# EAGLE schematic led-analog (EAGLE 9.5.2)
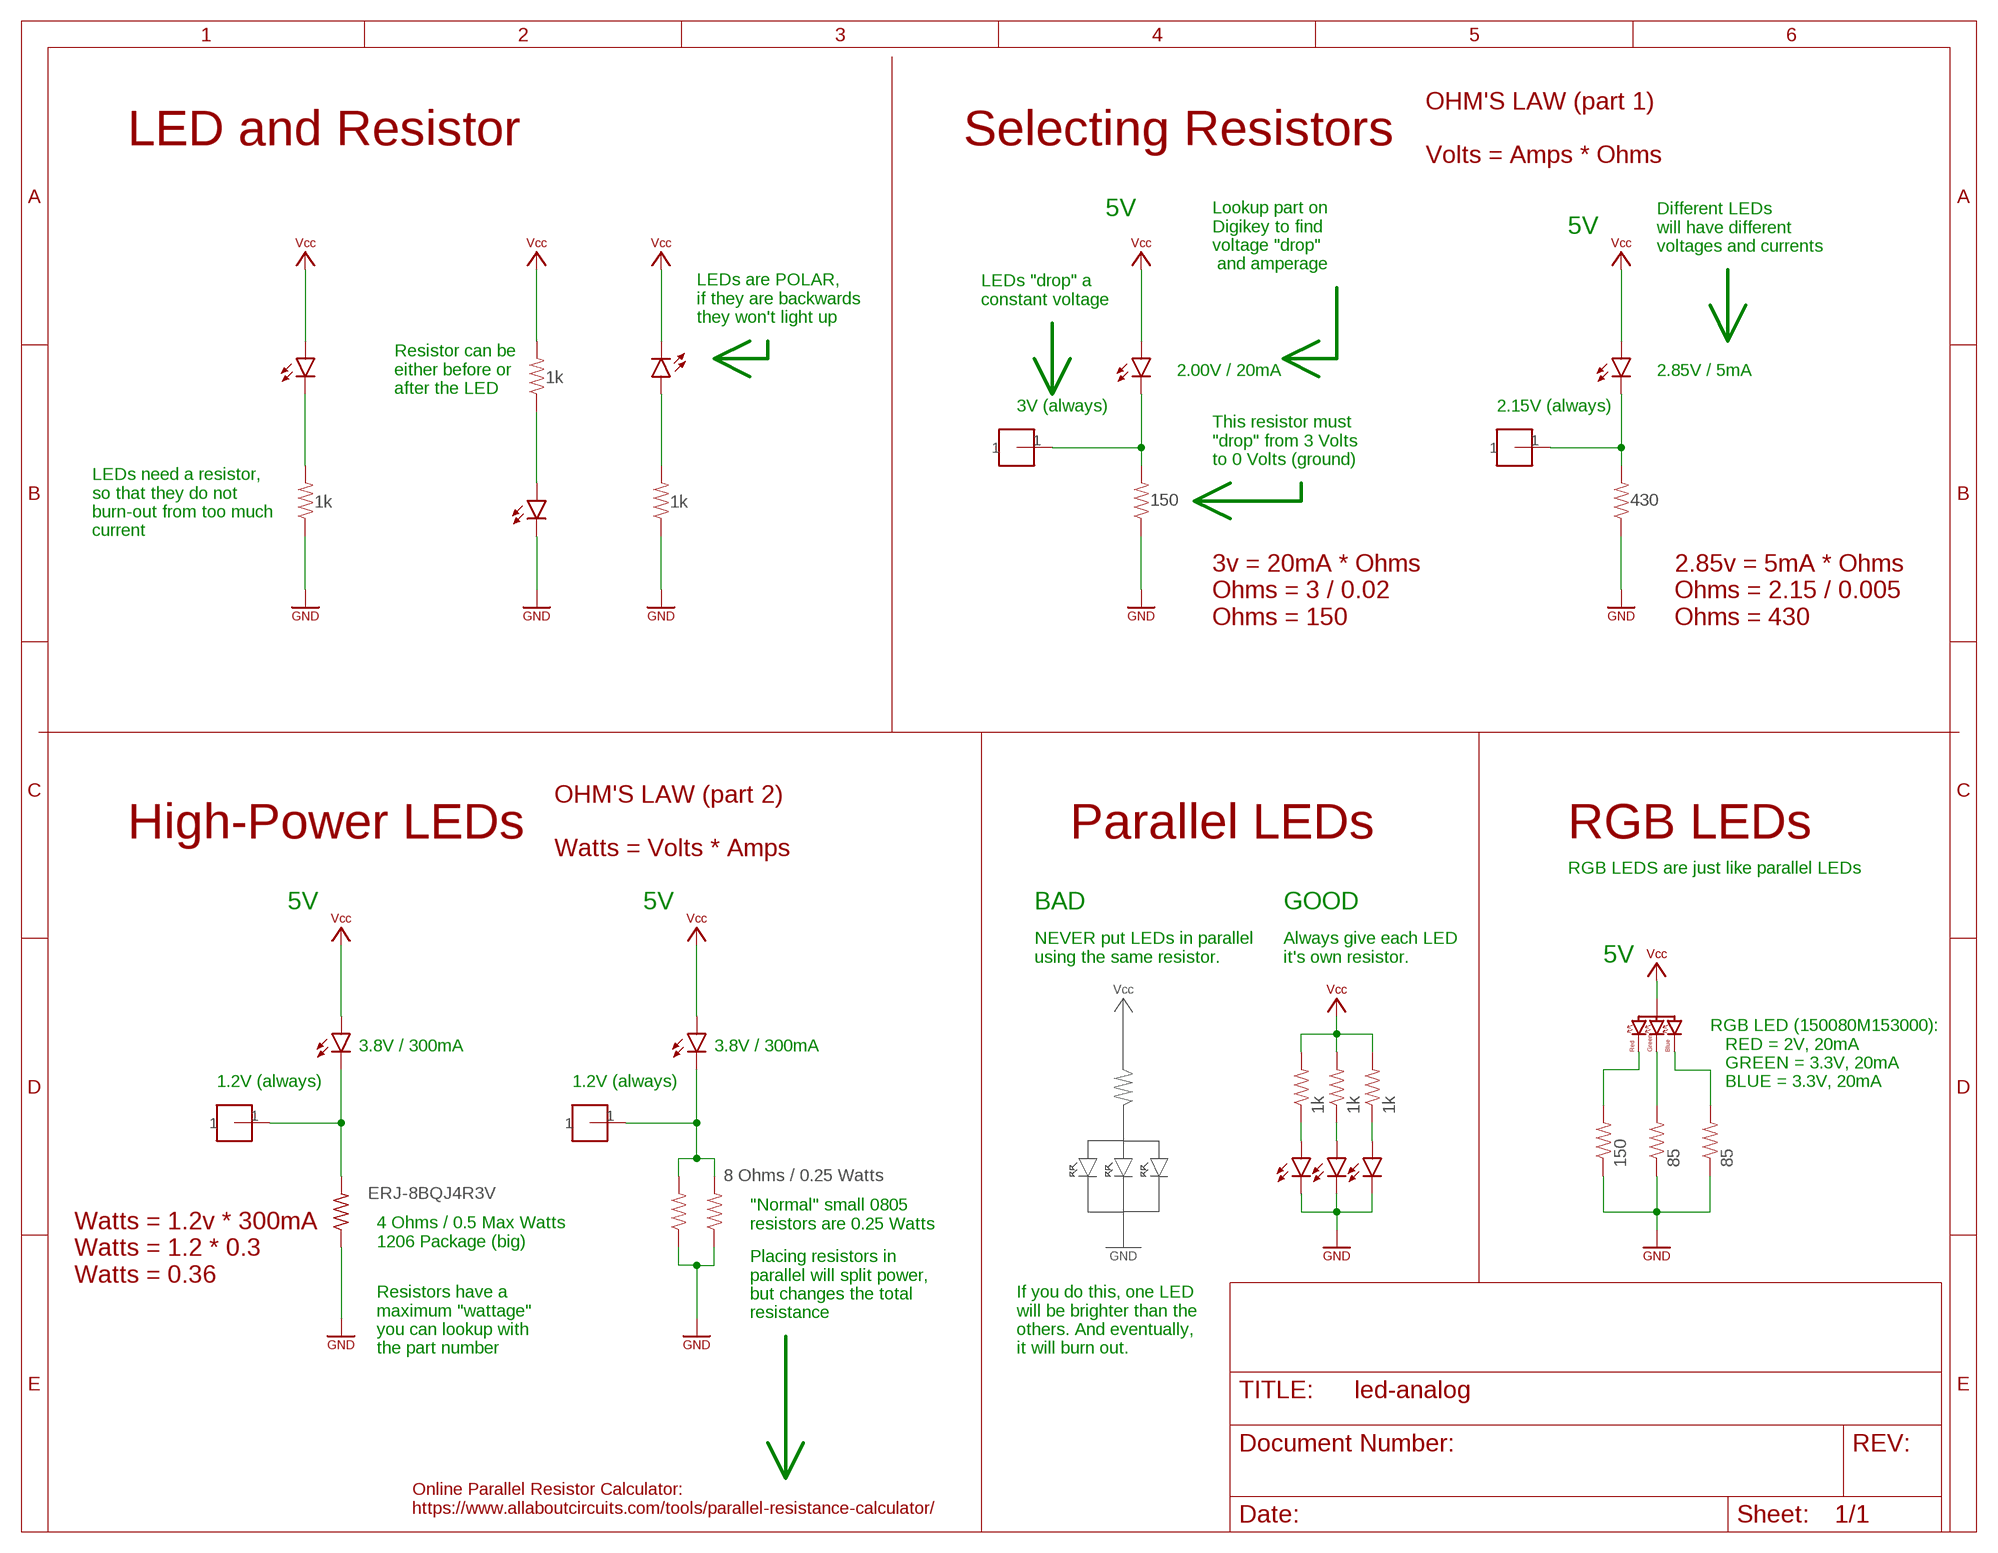
[diagram p0: schematic, sheet 1]

## Parts
LED3  LED-0805  [CHIP-LED0805]
LED4  LED-0805  [CHIP-LED0805]
LED5  LED-0805  [CHIP-LED0805]
LED6  LED-0805  [CHIP-LED0805]
LED7  LED-0805  [CHIP-LED0805]
LED8  LED-0805  [CHIP-LED0805]
LED9  LED-0805  [CHIP-LED0805]
LED10  LED-0805  [CHIP-LED0805]
LED11  LED-0805  [CHIP-LED0805]
LED12  LED-0805  [CHIP-LED0805]
R3  1k  COMPONENT_RESISTOR-0805  [0805]
R4  1k  COMPONENT_RESISTOR-0805  [0805]
R5  1k  COMPONENT_RESISTOR-0805  [0805]
R6  150  COMPONENT_RESISTOR-0805  [0805]
R7  85  COMPONENT_RESISTOR-0805  [0805]
R8  85  COMPONENT_RESISTOR-0805  [0805]
R9  1k  COMPONENT_RESISTOR-0805  [0805]
R10  1k  COMPONENT_RESISTOR-0805  [0805]
R11  1k  COMPONENT_RESISTOR-0805  [0805]
R12  430  COMPONENT_RESISTOR-0805  [0805]
R13  8 Ohms / 0.25 Watts  COMPONENT_RESISTOR-0805  [0805]
R14  ERJ-8BQJ4R3V  R-US_R1206  [R1206]
R15  150  COMPONENT_RESISTOR-0805  [0805]
R16  8 Ohms / 0.25 Watts  COMPONENT_RESISTOR-0805  [0805]
U$1  150080M153000  LED_RGB  [150080M153000]
U$2  HEADER-1-TESTPOINT  [TESTPOINT-1]
U$3  HEADER-1-TESTPOINT  [TESTPOINT-1]
U$4  HEADER-1-TESTPOINT  [TESTPOINT-1]
U$5  HEADER-1-TESTPOINT  [TESTPOINT-1]

## Nets
GND: LED3.C LED4.C LED5.C LED7.C R6.1 R7.1 R8.1 R9.1 R11.1 R12.1 R13.1 R14.1 R15.1 R16.1 ; supply symbol labelled SYMBOL_GND
N$3: LED3.A R3.1
N$4: LED4.A R4.1
N$5: LED5.A R5.1
N$6: R6.2 U$1.1(RED)
N$7: R7.2 U$1.2(GREEN)
N$8: R8.2 U$1.3(BLUE)
N$9: LED6.C R9.2
N$10: LED7.A R10.1
N$11: LED8.A R11.2
N$12: LED9.C R15.2 U$5.1
N$13: LED10.C R12.2 U$4.1
N$14: LED11.C R14.2 U$2.1
N$18: LED12.C R13.2 R16.2 U$3.1
VCC: LED6.A LED8.C LED9.A LED10.A LED11.A LED12.A R3.2 R4.2 R5.2 R10.2 U$1.4(ANODE) ; supply symbol labelled SYMBOL_VCC

## Notes on the sheet
- LED and Resistor | Selecting Resistors
- OHM'S LAW (part 1)
  
  Volts = Amps * Ohms
- 5V
- 5V
- Different LEDs
  will have different
  voltages and currents
- Lookup part on
  Digikey to find
  voltage "drop"
   and amperage
- LEDs "drop" a
  constant voltage
- LEDs are POLAR,
  if they are backwards
  they won't light up
- 2.00V / 20mA | 2.85V / 5mA
- Resistor can be
  either before or
  after the LED
- 3V (always) | 2.15V (always)
- This resistor must
  "drop" from 3 Volts
  to 0 Volts (ground)
- LEDs need a resistor,
  so that they do not
  burn-out from too much
  current
- 3v = 20mA * Ohms
  Ohms = 3 / 0.02
  Ohms = 150
- 2.85v = 5mA * Ohms
  Ohms = 2.15 / 0.005
  Ohms = 430
- High-Power LEDs | Parallel LEDs | RGB LEDs
- OHM'S LAW (part 2)
  
  Watts = Volts * Amps
- RGB LEDS are just like parallel LEDs
- 5V | 5V | BAD | GOOD
- NEVER put LEDs in parallel
  using the same resistor.
- Always give each LED
  it's own resistor.
- 5V
- Vcc
- 3.8V / 300mA | 3.8V / 300mA
- 1.2V (always) | 1.2V (always)
- RGB LED (150080M153000):
     RED = 2V, 20mA
     GREEN = 3.3V, 20mA
     BLUE = 3.3V, 20mA
- "Normal" small 0805
  resistors are 0.25 Watts
- 4 Ohms / 0.5 Max Watts
  1206 Package (big)
- GND
- Watts = 1.2v * 300mA
  Watts = 1.2 * 0.3
  Watts = 0.36
- Placing resistors in
  parallel will split power,
  but changes the total
  resistance
- Resistors have a
  maximum "wattage"
  you can lookup with
  the part number
- If you do this, one LED
  will be brighter than the
  others. And eventually,
  it will burn out.
- Online Parallel Resistor Calculator:
  https://www.allaboutcircuits.com/tools/parallel-resistance-calculator/

## Library data of the parts
LED3-LED12 = homemade-hardware:LED: LEDs Standard schematic elements and footprints for 5mm, 3mm, 1206, and 0603 sized LEDs. 5mm - Spark Fun Electronics SKU : COM-00529 (and others)
R3-R13 R15 R16 = homemade-hardware:COMPONENT_RESISTOR
R14 = adafruit:R-US_: RESISTOR, American symbol
U$1 = homemade-hardware:LED_RGB: 150080M153000 <https://www.digikey.com/product-detail/en/wurth-electronics-inc/150080M153000/732-11392-6-ND/7316254>: RGB LED (common anode); PN: 150080M153000
U$2-U$5 = homemade-hardware:HEADER-1: M20-8890845 <https://www.digikey.com/products/en?keywords=952-3236-ND>: Horizontal Male SMD Headers M20-7910842R <https://www.digikey.com/product-detail/en/harwin-inc/M20-7910842R/952-3200-6-ND/6559341>: Horizontal Female SMD Headers